# Altium schematic sheet linux-H-pin.SchDoc
size A3; SheetNumber: 2; SheetTotal: 2
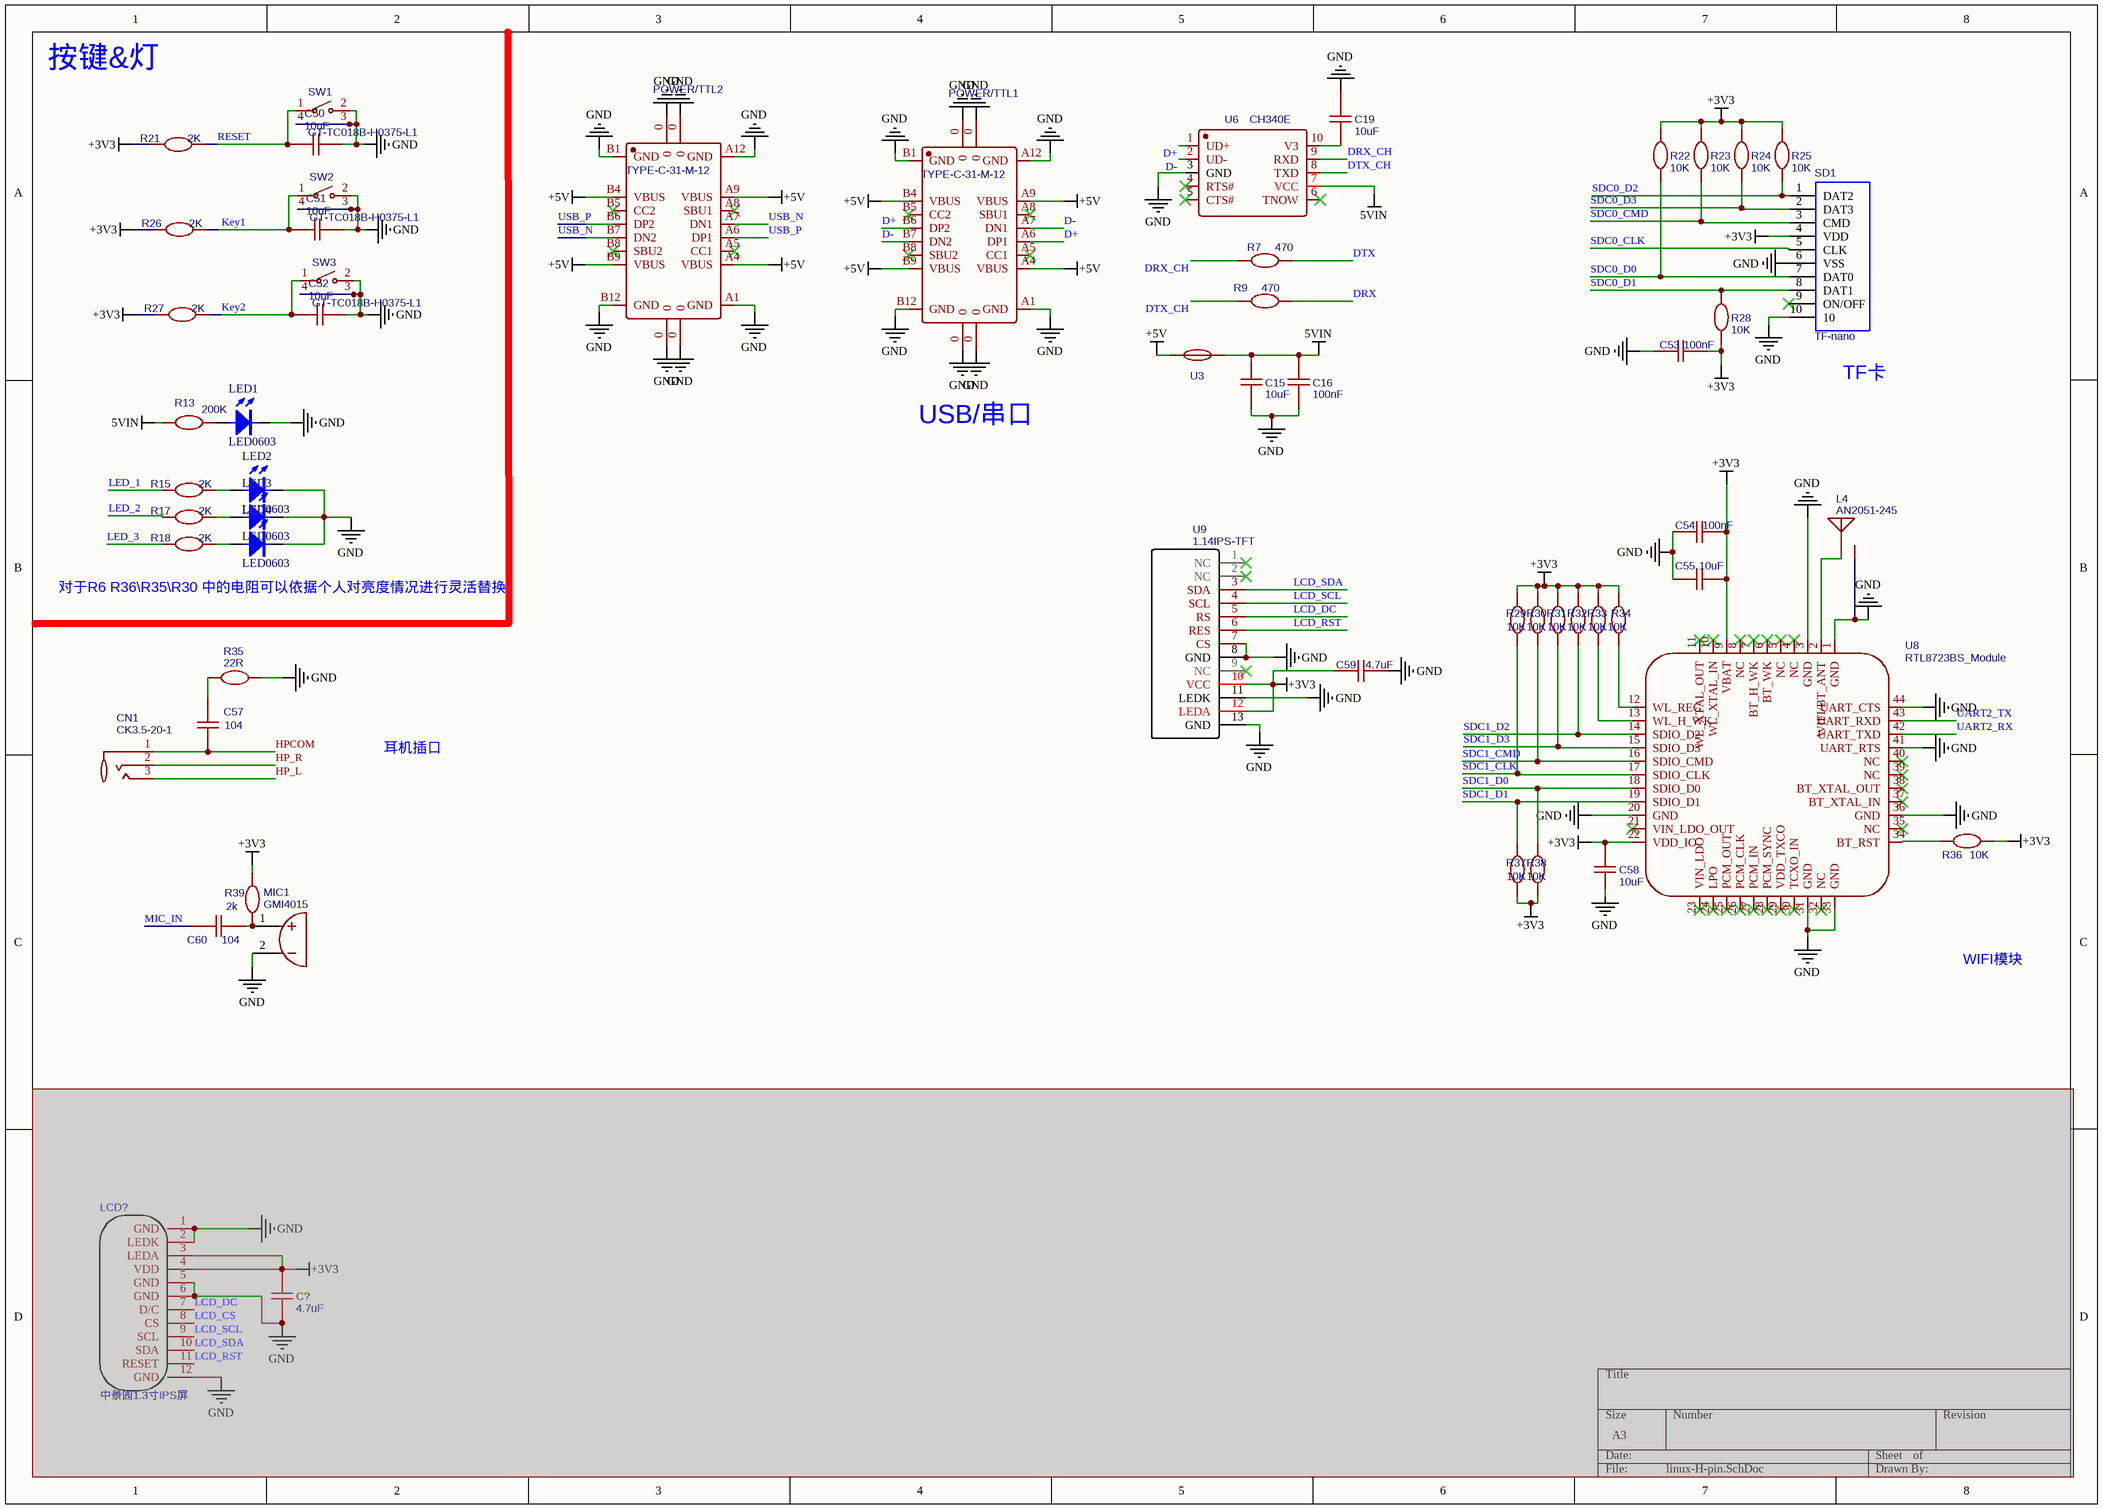
[diagram p0: linux-H-pin.SchDoc]

## Parts
C15  10uF  [C0603-S]
C16  100nF  [C0603-S]
C19  10uF  [C0603-S]
C50  10uF  [C0603-S]
C51  10uF  [C0603-S]
C52  10uF  [C0603-S]
C53  100nF  [C0603-S]
C54  100nF  [C0603-S]
C55  10uF  [C0603-S]
C57  104  [C0603-S]
C58  10uF  [C0603-S]
C59  4.7uF  [C0603-S]
C60  104  [C0603-S]
C?  4.7uF  [C0603-S]  (masked out: inside a compile mask, not in the netlist)
CN1  CK3.5-20-1  [AUDIO-SMD_CK3.5-20-1]
L4  AN2051-245  [ANT2051]
LCD?  中景园1.3寸IPS屏  [LCD-1.3寸中景园]  (masked out: inside a compile mask, not in the netlist)
LED1  LED0603  [LED0603]
LED2  LED0603  [LED0603]
LED3  LED0603  [LED0603]
LED4  LED0603  [LED0603]
MIC1  GMI4015  [MIC-TH_BD4.0-P2.00-D0.4-L-FD]
POWER/TTL1  TYPE-C-31-M-12  [USB-C_SMD-TYPE-C-31-M-12]
POWER/TTL2  TYPE-C-31-M-12  [USB-C_SMD-TYPE-C-31-M-12]
R7  470  [R0603-S]
R9  470  [R0603-S]
R13  200K  [R0603-S]
R15  2K  [R0603-S]
R17  2K  [R0603-S]
R18  2K  [R0603-S]
R21  2K  [R0603-S]
R22  10K  [R0603-S]
R23  10K  [R0603-S]
R24  10K  [R0603-S]
R25  10K  [R0603-S]
R26  2K  [R0603-S]
R27  2K  [R0603-S]
R28  10K  [R0603-S]
R29  10K  [R0603-S]
R30  10K  [R0603-S]
R31  10K  [R0603-S]
R32  10K  [R0603-S]
R33  10K  [R0603-S]
R34  10K  [R0603-S]
R35  22R  [R0603-S]
R36  10K  [R0603-S]
R37  10K  [R0603-S]
R38  10K  [R0603-S]
R39  2k  [R0603-S]
SD1  TF-nano  [TF-SOCKET - short]
SW1  GT-TC018B-H0375-L1  [SW-SMD_L4.7-W3.5-P3.35-EH]
SW2  GT-TC018B-H0375-L1  [SW-SMD_L4.7-W3.5-P3.35-EH]
SW3  GT-TC018B-H0375-L1  [SW-SMD_L4.7-W3.5-P3.35-EH]
U3  TLC-NSMD005  [R1206]  (value not drawn)
U6  CH340E  [MSOP-10_L3.0-W3.0-P0.50-LS5.0-BL]
U8  RTL8723BS_Module  [MOD-RTL8723BS_MODULE]
U9  1.14IPS-TFT  [1.14IPS]

## Nets
5VIN: C15.1 C16.1 R13.1 U3.1 U6.7(VCC)
+3V3: C53.1 C54.1 C55.1 C58.1 C59.1 R21.1 R22.1 R23.1 R24.1 R25.1 R26.1 R27.1 R28.2 R29.1 R30.1 R31.1 R32.1 R33.1 R34.1 R36.2 R37.2 R38.2 R39.2 SD1.4(VDD) U8.9(VBAT) U8.22(VDD_IO) U9.10(VCC) U9.12(LEDA)
+5V: POWER/TTL1.A4(VBUS) POWER/TTL1.A9(VBUS) POWER/TTL1.B4(VBUS) POWER/TTL1.B9(VBUS) POWER/TTL2.A4(VBUS) POWER/TTL2.A9(VBUS) POWER/TTL2.B4(VBUS) POWER/TTL2.B9(VBUS) U3.2
GND: C15.2 C16.2 C19.1 C50.2 C51.2 C52.2 C53.2 C54.2 C55.2 C58.2 C59.2 L4.2 LED1.2(C) LED2.2(C) LED3.2(C) LED4.2(C) MIC1.2 POWER/TTL1.0 POWER/TTL1.A1(GND) POWER/TTL1.A12(GND) POWER/TTL1.B1(GND) POWER/TTL1.B12(GND) POWER/TTL2.0 POWER/TTL2.A1(GND) POWER/TTL2.A12(GND) POWER/TTL2.B1(GND) POWER/TTL2.B12(GND) R35.1 SD1.6(VSS) SD1.10 SW1.2 SW1.3 SW1.4 SW2.2 SW2.3 SW2.4 SW3.2 SW3.3 SW3.4 U6.3(GND) U8.1(GND) U8.3(GND) U8.20(GND) U8.31(GND) U8.33(GND) U8.36(GND) U8.41(UART_RTS) U8.44(UART_CTS) U9.7(CS) U9.8(GND) U9.11(LEDK) U9.13(GND)
D+: POWER/TTL1.A6(DP1) POWER/TTL1.B6(DP2) U6.1(UD+)
D-: POWER/TTL1.A7(DN1) POWER/TTL1.B7(DN2) U6.2(UD-)
DRX: R9.2
DRX_CH: R7.1 U6.9(RXD)
DTX: R7.2
DTX_CH: R9.1 U6.8(TXD)
HP_L: CN1.3
HP_R: CN1.2
HPCOM: C57.1 CN1.1
Key1: C51.1 R26.2 SW2.1
Key2: C52.1 R27.2 SW3.1
LCD_DC: U9.5(RS)
LCD_RST: U9.6(RES)
LCD_SCL: U9.4(SCL)
LCD_SDA: U9.3(SDA)
LED_1: R15.1
LED_2: R17.1
LED_3: R18.1
MIC_IN: C60.1
RESET: C50.1 R21.2 SW1.1
SDC0_CLK: SD1.5(CLK)
SDC0_CMD: R23.2 SD1.3(CMD)
SDC0_D0: R22.2 SD1.7(DAT0)
SDC0_D1: R28.1 SD1.8(DAT1)
SDC0_D2: R25.2 SD1.1(DAT2)
SDC0_D3: R24.2 SD1.2(DAT3)
SDC1_CLK: R29.2 U8.17(SDIO_CLK)
SDC1_CMD: R30.2 U8.16(SDIO_CMD)
SDC1_D0: R38.1 U8.18(SDIO_D0)
SDC1_D1: R37.1 U8.19(SDIO_D1)
SDC1_D2: R32.2 U8.14(SDIO_D2)
SDC1_D3: R31.2 U8.15(SDIO_D3)
UART2_RX: U8.42(UART_TXD)
UART2_TX: U8.43(UART_RXD)
USB_N: POWER/TTL2.A7(DN1) POWER/TTL2.B7(DN2)
USB_P: POWER/TTL2.A6(DP1) POWER/TTL2.B6(DP2)
NetC19_2: C19.2 U6.10(V3)
NetC57_2: C57.2 R35.2
NetC60_2: C60.2 MIC1.1 R39.1
NetL4_1: L4.1(ANT) U8.2(WIFI/BT_ANT)
NetLED1_1: LED1.1(A) R13.2
NetLED2_1: LED2.1(A) R15.2
NetLED3_1: LED3.1(A) R17.2
NetLED4_1: LED4.1(A) R18.2
NetR33_2: R33.2 U8.13(WL_H_WK)
NetR34_2: R34.2 U8.12(WL_REG)
NetR36_1: R36.1 U8.34(BT_RST)

Not connected (* = marked no-connect by the designer): POWER/TTL1 A5(CC1)* A8(SBU1)* B5(CC2)* B8(SBU2)*; POWER/TTL2 A5(CC1)* A8(SBU1)* B5(CC2)* B8(SBU2)*; SD1 9(ON/OFF)*; U6 4(RTS#)* 5(CTS#)* 6(TNOW)*; U8 4(NC)* 5(NC)* 6(BT_WK)* 7(BT_H_WK)* 8(NC)* 10(WL_XTAL_IN)* 11(WL_XTAL_OUT)* 21(VIN_LDO_OUT)* 23(VIN_LDO)* 24(LPO)* 25(PCM_OUT)* 26(PCM_CLK)* 27(PCM_IN)* 28(PCM_SYNC)* 29(VDD_TXCO)* 30(TCXO_IN)* 32(NC)* 35(NC)* 37(BT_XTAL_IN)* 38(BT_XTAL_OUT)* 39(NC)* 40(NC)*; U9 1(NC)* 2(NC)* 9(NC)*

## Notes on the sheet
- 按键&灯
- (near SD1) TF卡
- USB/串口
- 对于R6 R36\R35\R30 中的电阻可以依据个人对亮度情况进行灵活替换
- 耳机插口
- WIFI模块

## Library data of the parts
C15 C19 C50-C52 C55 C58 = 10uF: BOM_Manufacturer: Taiyo Yuden; BOM_Manufacturer Part: AMK107BJ106MA-T; nameAlias: Capacitance; Contributor: LCSC; BOM_Supplier: LCSC; BOM_Supplier Part: C524952; spicePre: C; spiceSymbolName: AMK107BJ106MA-T
C16 C53 C54 = 100nF: BOM_Manufacturer: Taiyo Yuden; BOM_Manufacturer Part: AMK107BJ106MA-T; nameAlias: Capacitance; Contributor: LCSC; BOM_Supplier: LCSC; BOM_Supplier Part: C524952; spicePre: C; spiceSymbolName: AMK107BJ106MA-T
C57 C60 = 104: nameAlias: Value(F); Contributor: LCEDA_Lib; spicePre: C; spiceSymbolName: C_0603_US
C59 = 4.7uF: nameAlias: Value(F); Contributor: LCEDA_Lib; spicePre: C; spiceSymbolName: C_0603_US
C? = 4.7uF: BOM_Manufacturer: Taiyo Yuden; BOM_Manufacturer Part: AMK107BJ106MA-T; nameAlias: Capacitance; Contributor: LCSC; BOM_Supplier: LCSC; BOM_Supplier Part: C524952; spicePre: C; spiceSymbolName: AMK107BJ106MA-T
CN1 = CK3.5-20-1: BOM_Manufacturer: JINJIA; Contributor: LCSC; BOM_Supplier: LCSC; BOM_Supplier Part: C718046; BOM_Manufacturer Part: CK3.5-20-1; spicePre: C; spiceSymbolName: CK3.5-20-1
L4 = AN2051-245: BOM_Manufacturer: Rainsun; BOM_Supplier: LCSC; BOM_Manufacturer Part: AN2051-245; BOM_Supplier Part: C99727; BOM_JLCPCB Part Class: Extended Part; spicePre: L; spiceSymbolName: AN2051-245
LCD? = LCD-中景园1.3寸IPS屏: Contributor: huyangtu; spicePre: L; spiceSymbolName: 中景园1.3寸IPS屏
MIC1 = GMI4015: BOM_Manufacturer: INGHAi; BOM_Manufacturer Part: GMI4015P-2C-40db; Contributor: LCSC; BOM_Supplier: LCSC; BOM_Supplier Part: C233291; spicePre: M; spiceSymbolName: GMI4015P-2C-40DB
POWER/TTL1 POWER/TTL2 = TYPE-C-31-M-12: BOM_Manufacturer: Rectangular Connectors - Contacts; Contributor: LCSC; BOM_Supplier: LCSC; BOM_Supplier Part: C165948; BOM_Manufacturer Part: TYPE-C-31-M-12; spicePre: U; spiceSymbolName: TYPE-C-31-M-12
R7 R9 = 470: BOM_Manufacturer: PANASONIC; BOM_Manufacturer Part: ERA3ARB103V; nameAlias: Resistance (Ohms); Contributor: LCSC; BOM_Supplier: LCSC; BOM_Supplier Part: C465746; BOM_JLCPCB Part Class: Extended Part; spicePre: R; spiceSymbolName: ERA3ARB103V
R13 = 200K: BOM_Manufacturer: Ever Ohms Tech; BOM_Manufacturer Part: CR0603F12R4P05; nameAlias: Resistance (Ohms); Contributor: LCSC; BOM_Supplier: LCSC; BOM_Supplier Part: C429019; spicePre: R; spiceSymbolName: CR0603F12R4P05
R15 R17 R18 R21 R26 R27 = 2K: BOM_Manufacturer: PANASONIC; BOM_Manufacturer Part: ERA3ARB103V; nameAlias: Resistance (Ohms); Contributor: LCSC; BOM_Supplier: LCSC; BOM_Supplier Part: C465746; BOM_JLCPCB Part Class: Extended Part; spicePre: R; spiceSymbolName: ERA3ARB103V
R22-R25 R28-R34 R36-R38 = 10K: BOM_Manufacturer: PANASONIC; BOM_Manufacturer Part: ERA3ARB103V; nameAlias: Resistance (Ohms); Contributor: LCSC; BOM_Supplier: LCSC; BOM_Supplier Part: C465746; BOM_JLCPCB Part Class: Extended Part; spicePre: R; spiceSymbolName: ERA3ARB103V
R35 = 22R: nameAlias: Value(Ω); Contributor: LCEDA_Lib; spicePre: R; spiceSymbolName: R_0603_EU
R39 = 2k: BOM_Manufacturer: Ever Ohms Tech; BOM_Manufacturer Part: CR0603F12R4P05; nameAlias: Resistance (Ohms); Contributor: LCSC; BOM_Supplier: LCSC; BOM_Supplier Part: C429019; spicePre: R; spiceSymbolName: CR0603F12R4P05
SD1 = TF-nano: Contributor: LiShanwenGit; spicePre: S; spiceSymbolName: TF-nano
SW1-SW3 = KEY-TC018B-H0375-L1: BOM_Manufacturer: G-Switch(品赞); Contributor: LCSC; BOM_Supplier: LCSC; BOM_Supplier Part: C2762970; BOM_Manufacturer Part: GT-TC018B-H0375-L1; BOM_JLCPCB Part Class: Extended Part; spicePre: S; spiceSymbolName: GT-TC018B-H0375-L1
U3 = TLC-NSMD005: BOM_Manufacturer: TLC Electronic; Contributor: LCSC; SMT Type: Extend; BOM_Supplier: LCSC; BOM_Supplier Part: C261946; BOM_Manufacturer Part: TLC-NSMD005; BOM_JLCPCB SMD: Yes; spicePre: U; spiceSymbolName: TLC-NSMD005
U6 = CH340E: BOM_Manufacturer: WCH; SMT Type: Extend; BOM_Supplier: LCSC; BOM_Manufacturer Part: CH340E; BOM_Supplier Part: C99652; BOM_LCSC Assembly: Yes; spicePre: U; spiceSymbolName: CH340E
U8 = MOD-RTL8723BS_Module: Contributor: yanwudi; spicePre: U; spiceSymbolName: RTL8723BS_Module
U9 = 1.14IPS-TFT: Contributor: LiShanwenGit; spicePre: U; spiceSymbolName: 1.14IPS-TFT